# EAGLE design uMinion (EAGLE 9.2.2)
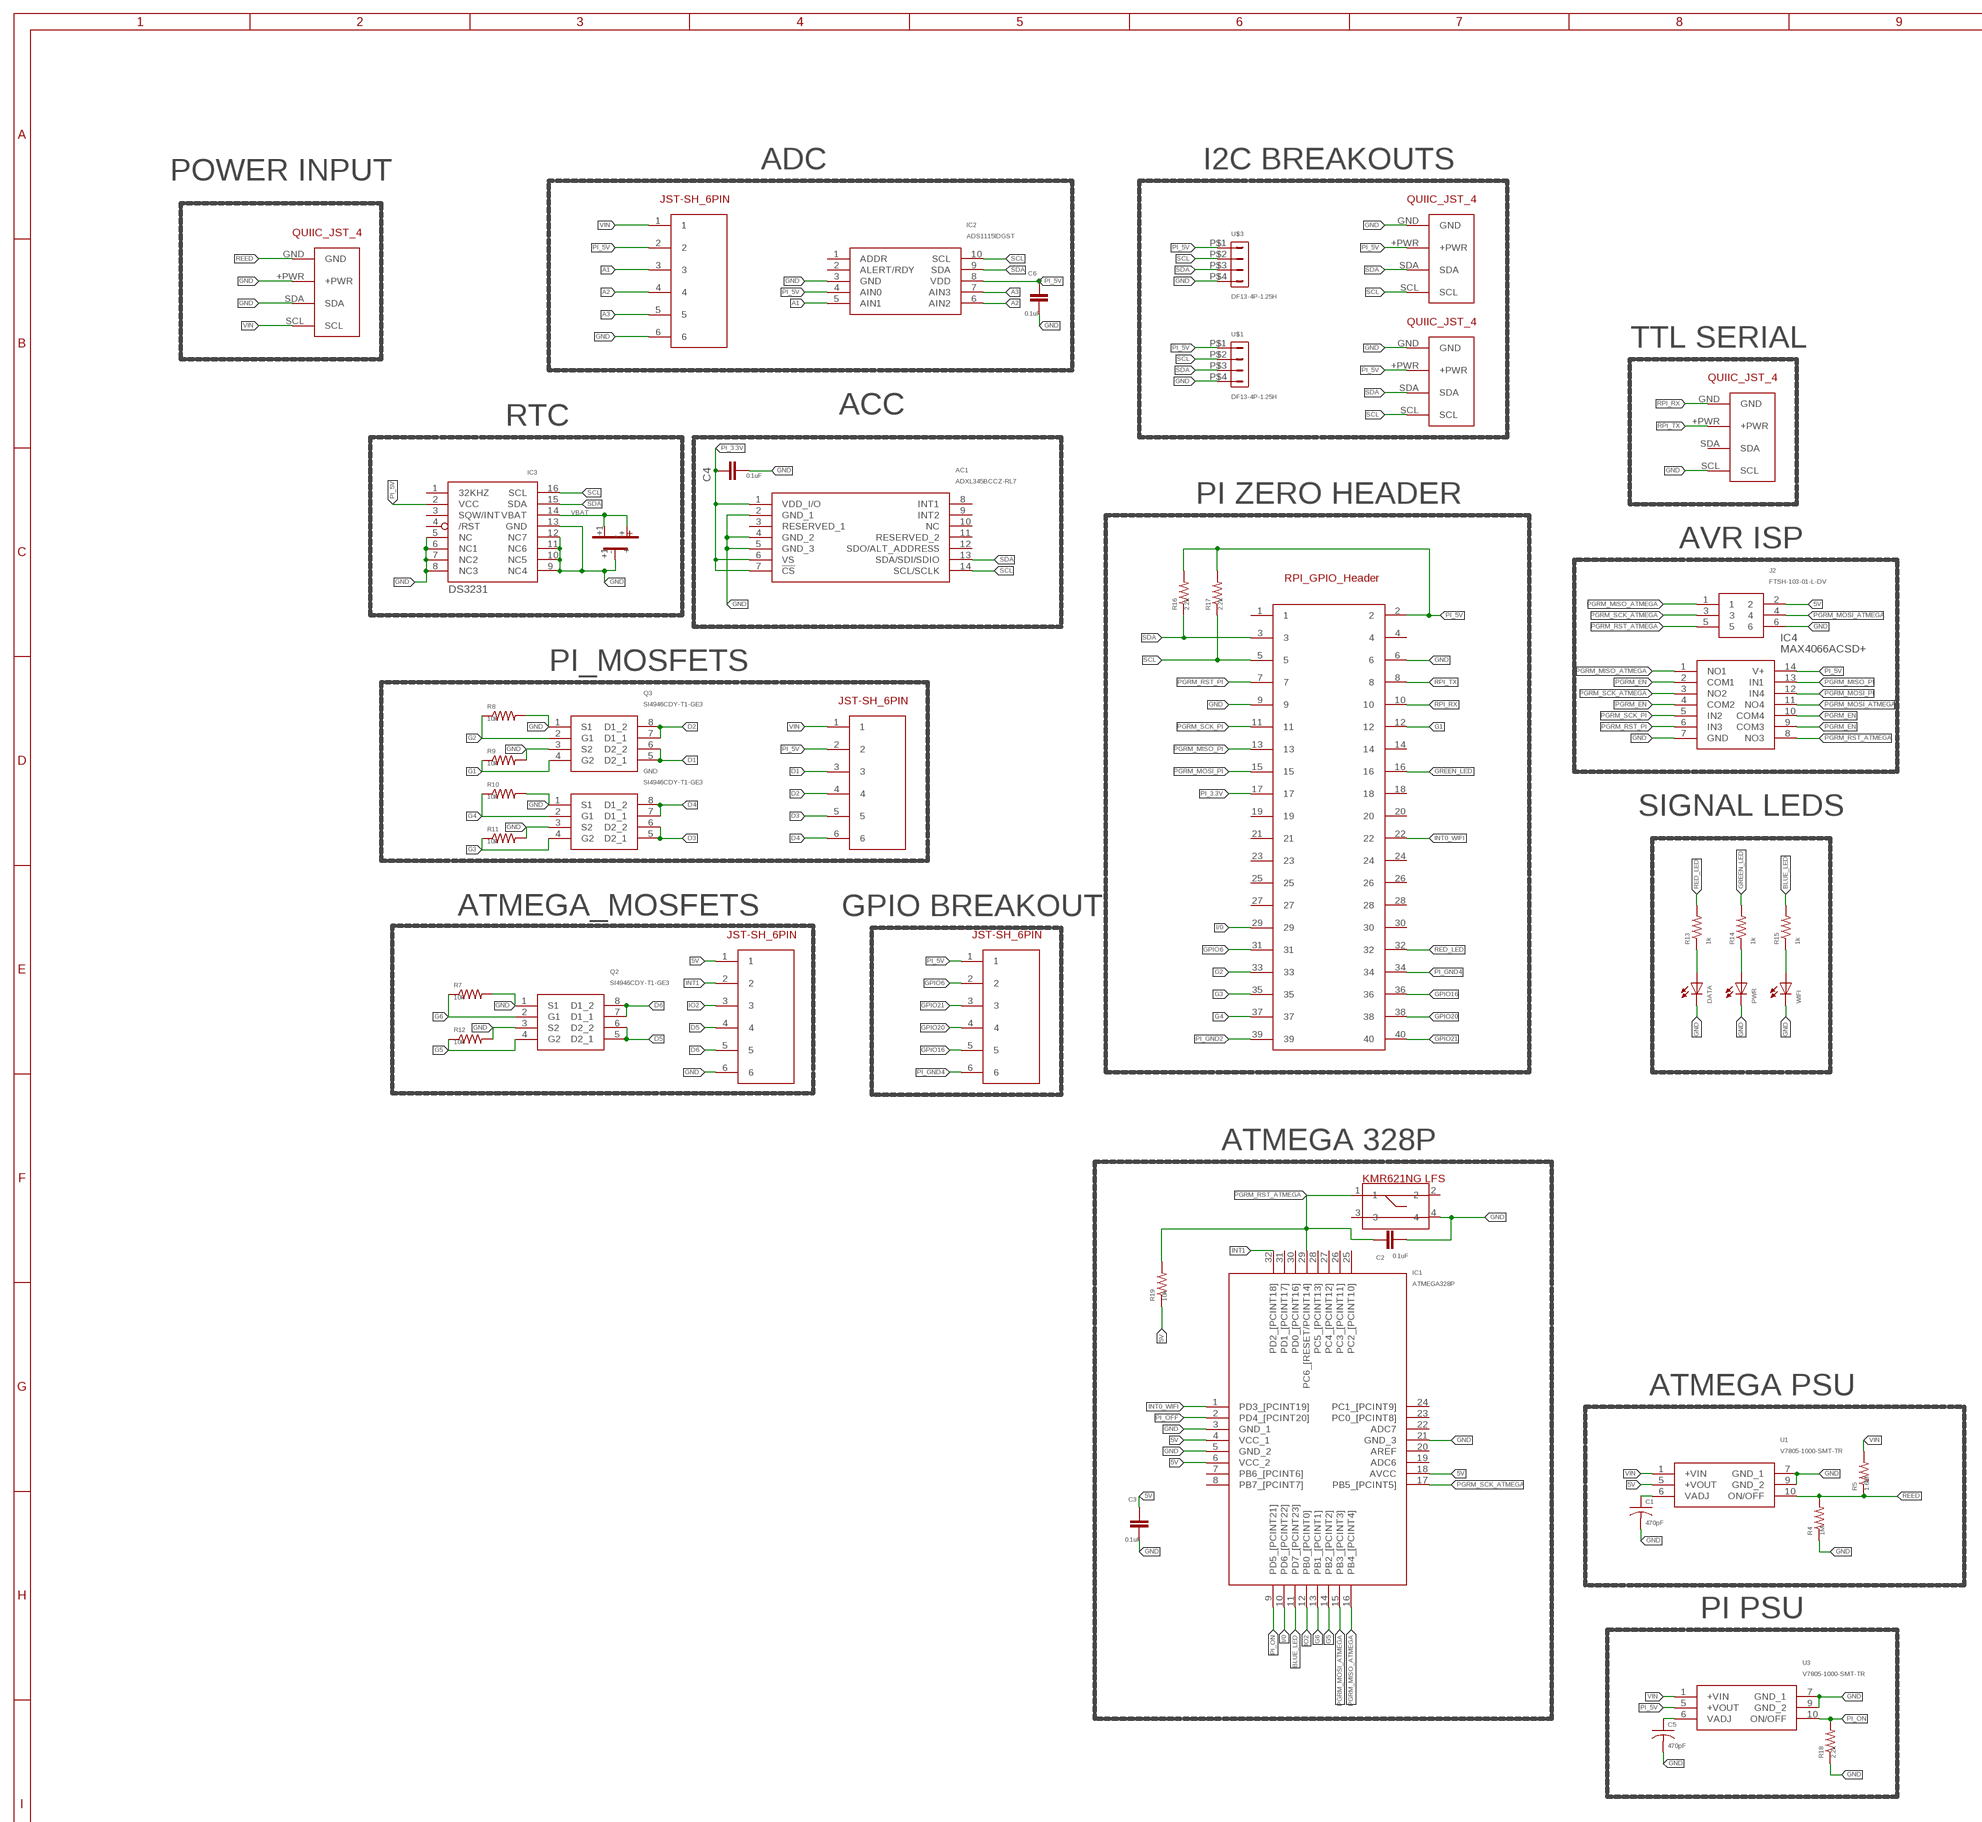
[diagram p0: schematic, sheet 1, part 1 of 2]
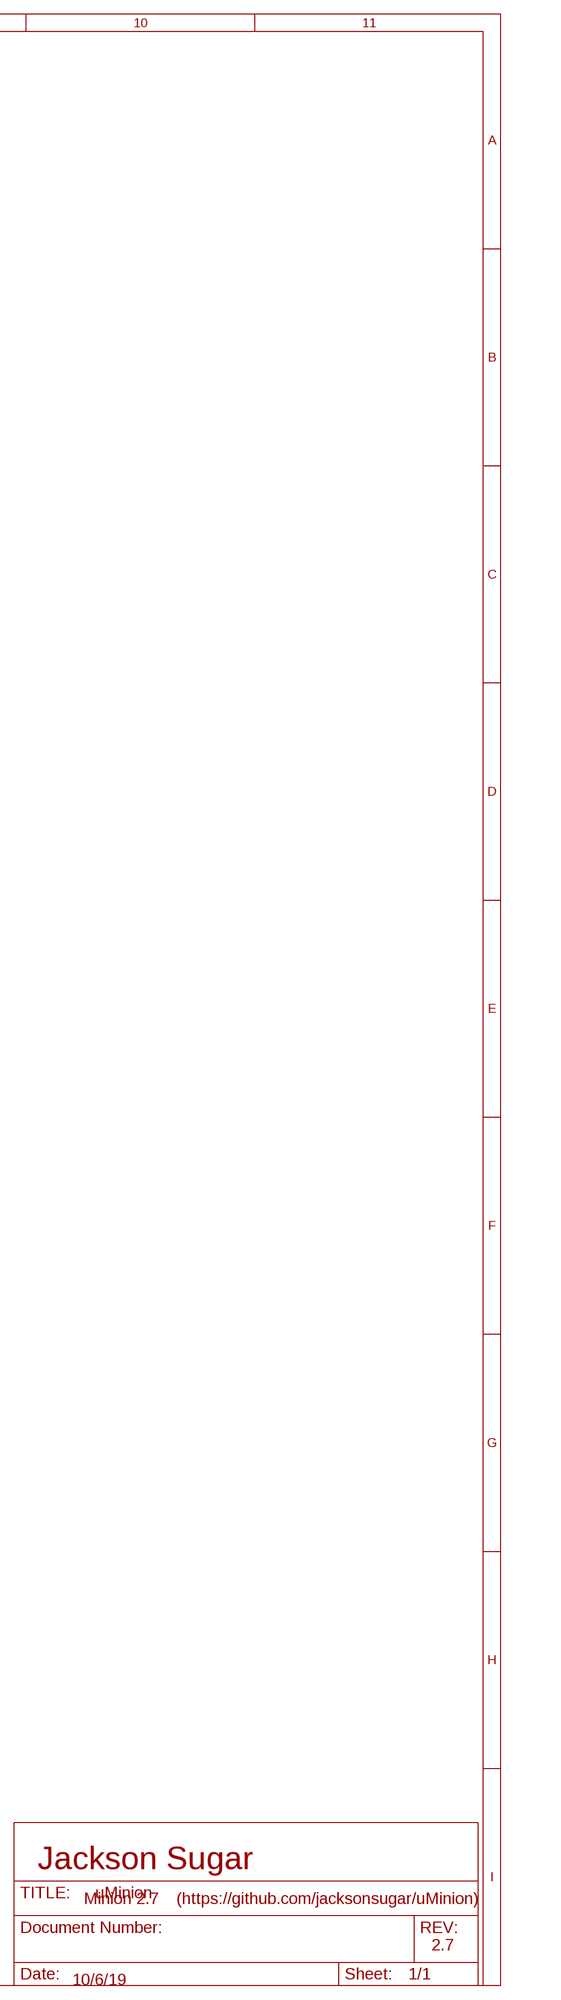
[diagram p1: schematic, sheet 1, part 2 of 2]

## Parts
AC1  ADXL345BCCZ-RL7  [CC-14-1]
C1  470pF  C-USC1206  [C1206]
C2  0.1uF  CC0805KRX7R9BB104  [CAP_0805]
C3  0.1uF  CC0805KRX7R9BB104  [CAP_0805]
C4  0.1uF  CC0805KRX7R9BB104  [CAP_0805]
C5  470pF  C-USC1206  [C1206]
C6  0.1uF  CC0805KRX7R9BB104  [CAP_0805]
DATA  LED_E  [LED_1206]
GND  SI4946CDY-T1-GE3  [SOIC127P600X175-8N]
IC1  ATMEGA328P  ATMEGA328P-AU  [QFP80P900X900X120-32N]
IC2  ADS1115IDGST  [SOP50P490X110-10N]
IC3  DS3231/SO  [SO16W]
IC4  MAX4066ACSD+  [SOIC127P600X175-14N]
J2  FTSH-103-01-L-DV  [SAMTEC_FTSH-103-01-L-DV]
PWR  LED_E  [LED_1206]
Q2  SI4946CDY-T1-GE3  [SOIC127P600X175-8N]
Q3  SI4946CDY-T1-GE3  [SOIC127P600X175-8N]
R4  1M  10KOHM-0603-1/10W-1%  [0603]
R5  1.6M  10KOHM-0603-1/10W-1%  [0603]
R7  10k  10KOHM-0603-1/10W-1%  [0603]
R8  10k  10KOHM-0603-1/10W-1%  [0603]
R9  10k  10KOHM-0603-1/10W-1%  [0603]
R10  10k  10KOHM-0603-1/10W-1%  [0603]
R11  10k  10KOHM-0603-1/10W-1%  [0603]
R12  10k  10KOHM-0603-1/10W-1%  [0603]
R13  1k  R-US_M1206  [M1206]
R14  1k  R-US_M1206  [M1206]
R15  1k  R-US_M1206  [M1206]
R16  2.2k  10KOHM-0603-1/10W-1%  [0603]
R17  2.2k  10KOHM-0603-1/10W-1%  [0603]
R18  2.2k  10KOHM-0603-1/10W-1%  [0603]
R19  10k  10KOHM-0603-1/10W-1%  [0603]
U1  V7805-1000-SMT-TR  [V7805500SMTTR]
U3  V7805-1000-SMT-TR  [V7805500SMTTR]
U$1  DF13-4P-1.25H  [DF13A-4P-1.25H]
U$2  JST-SH_6PIN  [JST-SH_6PIN]
U$3  DF13-4P-1.25H  [DF13A-4P-1.25H]
U$5  QUIIC_JST_4  [QUIIC_JST_4]
U$6  QUIIC_JST_4  [QUIIC_JST_4]
U$7  QUIIC_JST_4  [QUIIC_JST_4]
U$8  JST-SH_6PIN  [JST-SH_6PIN]
U$9  40PIN_FEMALE_HEADER_SMD  [40PIN_FEMALE_HEADER_SMD]
U$10  QUIIC_JST_4  [QUIIC_JST_4]
U$11  CR1220_HOLDER  [CR1220_HOLDER]
U$12  KMR621NGLFS  [KMR621NGLFS]
U$13  JST-SH_6PIN  [JST-SH_6PIN]
U$14  JST-SH_6PIN  [JST-SH_6PIN]
WIFI  LED_E  [LED_1206]

## Nets
5V: C3.1 IC1.4(VCC_1) IC1.6(VCC_2) IC1.18(AVCC) J2.2 R19.1 U1.5(+VOUT) U$14.1
A1: IC2.5(AIN1) U$2.3
A2: IC2.6(AIN2) U$2.4
A3: IC2.7(AIN3) U$2.5
BLUE_LED: IC1.11(PD7_[PCINT23]) R15.2
D1: Q3.5(D2_1) Q3.6(D2_2) U$8.3
D2: Q3.7(D1_1) Q3.8(D1_2) U$8.4
D3: GND.5(D2_1) GND.6(D2_2) U$8.5
D4: GND.7(D1_1) GND.8(D1_2) U$8.6
D5: Q2.5(D2_1) Q2.6(D2_2) U$14.4
D6: Q2.7(D1_1) Q2.8(D1_2) U$14.5
G1: Q3.4(G2) R9.1 U$9.12
G2: Q3.2(G1) R8.1 U$9.33
G3: GND.4(G2) R11.1 U$9.35
G4: GND.2(G1) R10.1 U$9.37
G5: IC1.14(PB2_[PCINT2]) Q2.4(G2) R12.1
G6: IC1.13(PB1_[PCINT1]) Q2.2(G1) R7.1
GND: AC1.2(GND_1) AC1.4(GND_2) AC1.5(GND_3) C1.2 C2.2 C3.2 C4.2 C5.2 C6.2 DATA.C GND.1(S1) GND.3(S2) IC1.3(GND_1) IC1.5(GND_2) IC1.21(GND_3) IC2.3(GND) IC3.5(NC) IC3.6(NC1) IC3.7(NC2) IC3.8(NC3) IC3.9(NC4) IC3.10(NC5) IC3.11(NC6) IC3.12(NC7) IC3.13(GND) IC4.7(GND) J2.6 PWR.C Q2.1(S1) Q2.3(S2) Q3.1(S1) Q3.3(S2) R4.1 R7.2 R8.2 R9.2 R10.2 R11.2 R12.2 R18.1 U1.7(GND_1) U1.9(GND_2) U3.7(GND_1) U3.9(GND_2) U$1.P$4 U$2.6 U$3.P$4 U$5.SCL U$6.GND U$7.GND U$9.6 U$9.9 U$10.+PWR U$10.SDA U$11.- U$12.4 U$14.6 WIFI.C
GPIO6: U$9.31 U$13.2
GPIO16: U$9.36 U$13.5
GPIO20: U$9.38 U$13.4
GPIO21: U$9.40 U$13.3
GREEN_LED: R14.2 U$9.16
I/0: IC1.10(PD6_[PCINT22]) U$9.29
INT0_WIFI: IC1.1(PD3_[PCINT19]) U$9.22
INT1: IC1.32(PD2_[PCINT18]) U$14.2
IO2: IC1.12(PB0_[PCINT0]) U$14.3
N$2: C1.1 U1.6(VADJ)
N$3: C5.1 U3.6(VADJ)
N$8: R15.1 WIFI.A
N$10: DATA.A R13.1
N$11: PWR.A R14.1
PGRM_EN: IC4.2(COM1) IC4.4(COM2) IC4.9(COM3) IC4.10(COM4)
PGRM_MISO_ATMEGA: IC1.16(PB4_[PCINT4]) IC4.1(NO1) J2.1
PGRM_MISO_PI: IC4.13(IN1) U$9.13
PGRM_MOSI_ATMEGA: IC1.15(PB3_[PCINT3]) IC4.11(NO4) J2.4
PGRM_MOSI_PI: IC4.12(IN4) U$9.15
PGRM_RST_ATMEGA: C2.1 IC1.29(PC6_[RESET/PCINT14]) IC4.8(NO3) J2.5 R19.2 U$12.1
PGRM_RST_PI: IC4.6(IN3) U$9.7
PGRM_SCK_ATMEGA: IC1.17(PB5_[PCINT5]) IC4.3(NO2) J2.3
PGRM_SCK_PI: IC4.5(IN2) U$9.11
PI_3.3V: AC1.1(VDD_I/O) AC1.6(VS) AC1.7(!CS) C4.1 U$9.17
PI_5V: C6.1 IC2.4(AIN0) IC2.8(VDD) IC3.2(VCC) IC4.14(V+) R16.2 R17.2 U3.5(+VOUT) U$1.P$1 U$2.2 U$3.P$1 U$6.+PWR U$7.+PWR U$8.2 U$9.2 U$13.1
PI_GND2: U$9.39
PI_GND4: U$9.34 U$13.6
PI_OFF: IC1.2(PD4_[PCINT20])
PI_ON: IC1.9(PD5_[PCINT21]) R18.2 U3.10(ON/OFF)
RED_LED: R13.2 U$9.32
REED: R4.2 R5.1 U1.10(ON/OFF) U$10.GND
RPI_RX: U$5.GND U$9.10
RPI_TX: U$5.+PWR U$9.8
SCL: AC1.14(SCL/SCLK) IC2.10(SCL) IC3.16(SCL) R17.1 U$1.P$2 U$3.P$2 U$6.SCL U$7.SCL U$9.5
SDA: AC1.13(SDA/SDI/SDIO) IC2.9(SDA) IC3.15(SDA) R16.1 U$1.P$3 U$3.P$3 U$6.SDA U$7.SDA U$9.3
VBAT: IC3.14(VBAT) U$11.+ U$11.+1
VIN: R5.2 U1.1(+VIN) U3.1(+VIN) U$2.1 U$8.1 U$10.SCL
Unconnected: AC1.3(RESERVED_1) AC1.8(INT1) AC1.9(INT2) AC1.10(NC) AC1.11(RESERVED_2) AC1.12(SDO/ALT_ADDRESS) IC1.7(PB6_[PCINT6]) IC1.8(PB7_[PCINT7]) IC1.19(ADC6) IC1.20(AREF) IC1.22(ADC7) IC1.23(PC0_[PCINT8]) IC1.24(PC1_[PCINT9]) IC1.25(PC2_[PCINT10]) IC1.26(PC3_[PCINT11]) IC1.27(PC4_[PCINT12]) IC1.28(PC5_[PCINT13]) IC1.30(PD0_[PCINT16]) IC1.31(PD1_[PCINT17]) IC2.1(ADDR) IC2.2(ALERT/RDY) IC3.1(32KHZ) IC3.3(SQW/INT) IC3.4(/RST) U$5.SDA U$9.1 U$9.4 U$9.14 U$9.18 U$9.19 U$9.20 U$9.21 U$9.23 U$9.24 U$9.25 U$9.26 U$9.27 U$9.28 U$9.30 U$12.2 U$12.3

## Notes on the sheet
- ADC | I2C BREAKOUTS
- POWER INPUT
- TTL SERIAL
- ACC
- RTC
- PI ZERO HEADER
- AVR ISP
- PI_MOSFETS
- SIGNAL LEDS
- ATMEGA_MOSFETS | GPIO BREAKOUT
- ATMEGA 328P
- ATMEGA PSU
- PI PSU
- Jackson Sugar
- Minion 2.7 | (https://github.com/jacksonsugar/uMinion)
- 2.7
- 10/6/19

## Library data of the parts
AC1 = SamacSys_Parts:ADXL345BCCZ-RL7: ADXL345BCCZ-RL7 Analog Devices, 3-Axis Accelerometer, I2C, SPI, 14-Pin LGA Source: Datasheet <https://componentsearchengine.com/Datasheets/1/ADXL345BCCZ-RL7.pdf>; DESCRIPTION: ADXL345BCCZ-RL7 Analog Devices, 3-Axis Accelerometer, I2C, SPI, 14-Pin LGA; HEIGHT: mm; MANUFACTURER_NAME: Analog Devices; MANUFACTURER_PART_NUMBER: ADXL345BCCZ-RL7; MOUSER_PART_NUMBER: 584-ADXL345BCCZ-R7
C1 C5 = adafruit:C-US: CAPACITOR, American symbol
C2-C4 C6 = Resistor_Capacitor:CC0805KRX7R9BB104: CAP CER 0.1UF 50V X7R 0805 Manufacturer's datasheet <http://www.yageo.com/documents/recent/UPY-GPHC_X7R_6.3V-to-50V_18.pdf>; CREATED_BY: PCBLayout.com; DIGIKEY_PART_NUMBER: 311-1140-2-ND; MANUFACTURER: Yageo; MPN: CC0805KRX7R9BB104; PACKAGE: SMD 0805
DATA PWR WIFI = eagle-ltspice:LED_E: LED Source: http://www.osram.convergy.de Source: www.luxeon.com Source: www.kingbright.com; SPICEMODEL: NONE; SPICEPREFIX: D; SPICETYPE: diode
GND Q2 Q3 = SamacSys_Parts:SI4946CDY-T1-GE3: VISHAY - SI4946CDY-T1-GE3 - MOSFET, DUAL N-CH, 60V, SOIC Source: Datasheet <https://componentsearchengine.com/Datasheets/1/SI4946CDY-T1-GE3.pdf>; DESCRIPTION: VISHAY - SI4946CDY-T1-GE3 - MOSFET, DUAL N-CH, 60V, SOIC; HEIGHT: 1.75mm; MANUFACTURER_NAME: Vishay; MANUFACTURER_PART_NUMBER: SI4946CDY-T1-GE3; MOUSER_PART_NUMBER: 78-SI4946CDY-T1-GE3
IC1 = SamacSys_Parts:ATMEGA328P-AU: MICROCHIP - ATMEGA328P-AU. - MICROCONTROLLER MCU, 8 BIT, ATMEGA, 20MHZ, TQFP-32 Source: Datasheet <https://componentsearchengine.com/Datasheets/1/ATMEGA328P-AU.pdf>; DESCRIPTION: MICROCHIP - ATMEGA328P-AU. - MICROCONTROLLER MCU, 8 BIT, ATMEGA, 20MHZ, TQFP-32; HEIGHT: 1.2mm; MANUFACTURER_NAME: Microchip; MANUFACTURER_PART_NUMBER: ATMEGA328P-AU; MOUSER_PART_NUMBER: 556-ATMEGA328P-AU
IC2 = SamacSys_Parts:ADS1115IDGST: 16-Bit, 860SPS, 4-Ch Delta-Sigma ADC w/ PGA, Oscillator, Voltage Reference, Comparator & I2C Source: Datasheet; DESCRIPTION: 16-Bit, 860SPS, 4-Ch Delta-Sigma ADC w/ PGA, Oscillator, Voltage Reference, Comparator & I2C; HEIGHT: 1.1mm; MANUFACTURER_NAME: Texas Instruments; MANUFACTURER_PART_NUMBER: ADS1115IDGST; MOUSER_PART_NUMBER: 595-ADS1115IDGST
IC3 = adafruit:DS3231
IC4 = SamacSys_Parts:MAX4066ACSD+: MAX4066ACSD+, Analogue SPST Switch Quad SPST, 3, 5, 12V, 14-Pin, SOIC Source: Datasheet <https://componentsearchengine.com/Datasheets/1/MAX4066ACSD .pdf>; DESCRIPTION: MAX4066ACSD+, Analogue SPST Switch Quad SPST, 3, 5, 12V, 14-Pin, SOIC; HEIGHT: 1.75mm; MANUFACTURER_NAME: Maxim Integrated; MANUFACTURER_PART_NUMBER: MAX4066ACSD+; MOUSER_PART_NUMBER: 700-MAX4066ACSD; MOUSER_PRICE-STOCK: https://www.mouser.com/Search/Refine.aspx?Keyword=700-MAX4066ACSD
J2 = SamacSys_Parts:FTSH-103-01-L-DV: CONN HEADER, 1.27MM, 2X3WAY, SMT Source: Datasheet <https://componentsearchengine.com/Datasheets/1/FTSH-103-01-L-DV.pdf>; DESCRIPTION: CONN HEADER, 1.27MM, 2X3WAY, SMT; HEIGHT: mm; MANUFACTURER_NAME: SAMTEC; MANUFACTURER_PART_NUMBER: FTSH-103-01-L-DV; MOUSER_PART_NUMBER: 200-FTSH10301LDV
R4 R5 R16-R18 = SparkFun-Resistors:10KOHM: 10kΩ resistor A resistor is a passive two-terminal electrical component that implements electrical resistance as a circuit element. Resistors act to reduce current flow, and, at the same time, act to lower voltage levels within circuits. - Wikipedia; PROD_ID: RES-00824; VALUE: 10k
R7-R12 R19 = SparkFun-Resistors:10KOHM: 10kΩ resistor A resistor is a passive two-terminal electrical component that implements electrical resistance as a circuit element. Resistors act to reduce current flow, and, at the same time, act to lower voltage levels within circuits. - Wikipedia; PROD_ID: RES-00824
R13-R15 = rcl:R-US_: RESISTOR, American symbol; SPICEPREFIX: R
U1 U3 = SamacSys_Parts:V7805-1000-SMT-TR: Non-Isolated DC/DC Converters Non-Isolated D C-DC Cnvrt Source: Datasheet <https://componentsearchengine.com/Datasheets/1/V7805-1000-SMT-TR.pdf>; DESCRIPTION: Non-Isolated DC/DC Converters Non-Isolated D C-DC Cnvrt; HEIGHT: 7mm; MANUFACTURER_NAME: CUI; MANUFACTURER_PART_NUMBER: V7805-1000-SMT-TR; MOUSER_PART_NUMBER: 490-V78051000-SMT-TR; MOUSER_PRICE-STOCK: https://www.mouser.com/Search/Refine.aspx?Keyword=490-V78051000-SMT-TR
U$1 U$3 = con-hirose-df13:DF13-4P-1.25: DF13-4P 1.25mm Pitch Miniature Crimping Connector.
U$2 U$8 U$13 U$14 = JST-SH_6PIN:JST-SH_6PIN
U$5-U$7 U$10 = QUIIC_JST_4:QUIIC_JST_4
U$9 = 40Pin_Female_Header_SMD:40PIN_FEMALE_HEADER_SMD
U$11 = CR1220_HOLDER:CR1220_HOLDER
U$12 = KMR621NG LFS:KMR621NGLFS

## Board
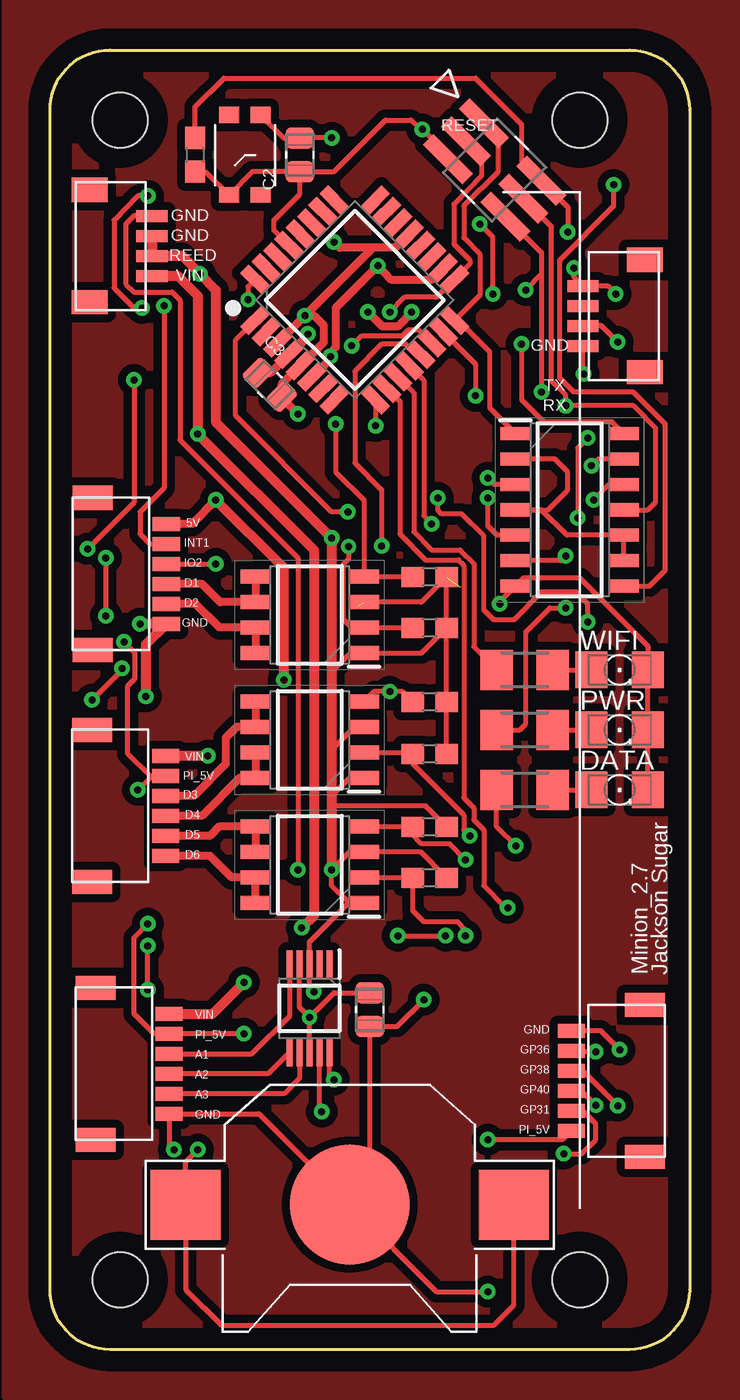
[diagram p2: board, top side]
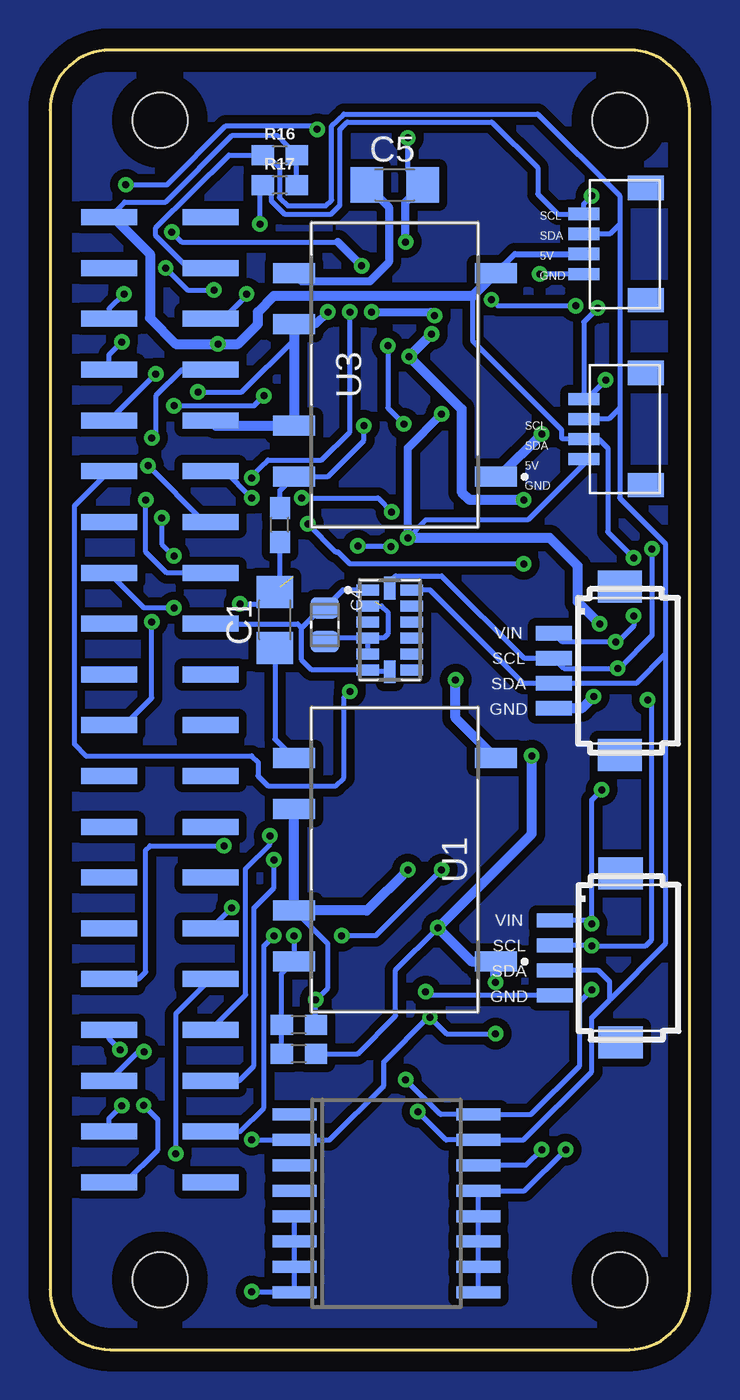
[diagram p3: board, bottom side, seen from below]

Size 32 x 65 mm. Coordinates in mm from the lower left corner, seen from the top.
Outline: 0,3 0,62 arc-90 3,65 29,65 arc-90 32,62 32,3 arc-90 29,0 3,0 arc-90 0,3
Copper layers (1*16): Top 0.035mm / dielectric 1.5mm / Bottom 0.035mm
Design rules "default": minimum track width 6mil, minimum drill 0.35mm, track to track 6mil, track to pad 6mil, pad to pad 6mil, via to via 6mil, smd to smd 6mil, copper to edge 40mil, drill to drill 6mil, minimum pad ring 10mil, minimum via ring 8mil, stop-mask expansion 4mil, vias tented up to drill 0mil, thermal gap 10mil
Holes 2.75 mm at 3.5,61.5 3.5,3.5 26.5,3.5 26.5,61.5

### Footprints (pad centres in the part's own frame; a part is rotated, then mirrored left to right if it is on the bottom)
CC-14-1 = smd 1.145 x 0.55: 1 -1.097,2; 2 -1.097,1.2; 3 -1.097,0.4; 4 -1.097,-0.4; 5 -1.097,-1.2; 6 -1.097,-2; 8 1.097,-2; 9 1.097,-1.2; 10 1.097,-0.4; 11 1.097,0.4; 12 1.097,1.2; 13 1.097,2 | smd 0.55 x 1.145: 7 0,-2.098; 14 0,2.098
C1206 = smd 1.6 x 1.8: 1 -1.4,0; 2 1.4,0
CAP_0805 = smd 1.05 x 1.38: 1 -0.84,0; 2 0.84,0
LED_1206 = smd 1.6 x 1.803: A -1.422,0; C 1.422,0
SOIC127P600X175-8N = smd 1.525 x 0.7: 1 -2.712,1.905; 2 -2.712,0.635; 3 -2.712,-0.635; 4 -2.712,-1.905; 5 2.712,-1.905; 6 2.712,-0.635; 7 2.712,0.635; 8 2.712,1.905
QFP80P900X900X120-32N = smd 1.5 x 0.6: 1 -4.25,2.8; 2 -4.25,2; 3 -4.25,1.2; 4 -4.25,0.4; 5 -4.25,-0.4; 6 -4.25,-1.2; 7 -4.25,-2; 8 -4.25,-2.8; 17 4.25,-2.8; 18 4.25,-2; 19 4.25,-1.2; 20 4.25,-0.4; 21 4.25,0.4; 22 4.25,1.2; 23 4.25,2; 24 4.25,2.8 | smd 0.6 x 1.5: 9 -2.8,-4.25; 10 -2,-4.25; 11 -1.2,-4.25; 12 -0.4,-4.25; 13 0.4,-4.25; 14 1.2,-4.25; 15 2,-4.25; 16 2.8,-4.25; 25 2.8,4.25; 26 2,4.25; 27 1.2,4.25; 28 0.4,4.25; 29 -0.4,4.25; 30 -1.2,4.25; 31 -2,4.25; 32 -2.8,4.25
SOP50P490X110-10N = smd 1.4 x 0.3: 1 -2.2,1; 2 -2.2,0.5; 3 -2.2,0; 4 -2.2,-0.5; 5 -2.2,-1; 6 2.2,-1; 7 2.2,-0.5; 8 2.2,0; 9 2.2,0.5; 10 2.2,1
SO16W = smd 0.6 x 2.2: 1 -4.445,-4.6; 2 -3.175,-4.6; 3 -1.905,-4.6; 4 -0.635,-4.6; 5 0.635,-4.6; 6 1.905,-4.6; 7 3.175,-4.6; 8 4.445,-4.6; 9 4.445,4.6; 10 3.175,4.6; 11 1.905,4.6; 12 0.635,4.6; 13 -0.635,4.6; 14 -1.905,4.6; 15 -3.175,4.6; 16 -4.445,4.6
SOIC127P600X175-14N = smd 1.525 x 0.65: 1 -2.712,3.81; 2 -2.712,2.54; 3 -2.712,1.27; 4 -2.712,0; 5 -2.712,-1.27; 6 -2.712,-2.54; 7 -2.712,-3.81; 8 2.712,-3.81; 9 2.712,-2.54; 10 2.712,-1.27; 11 2.712,0; 12 2.712,1.27; 13 2.712,2.54; 14 2.712,3.81
SAMTEC_FTSH-103-01-L-DV = smd 0.762 x 2.794: 1 -1.27,-2.032; 2 -1.27,2.032; 3 0,-2.032; 4 0,2.032; 5 1.27,-2.032; 6 1.27,2.032
0603 = smd 1.1 x 1: 1 -0.85,0; 2 0.85,0
M1206 = smd 1.6 x 2: 1 -1.4,0; 2 1.4,0
V7805500SMTTR = smd 1 x 2.1: 1 -5.08,-4.8; 5 5.08,-4.8; 6 5.08,5.3; 7 2.54,5.3; 9 -2.54,5.3; 10 -5.08,5.3
DF13A-4P-1.25H = smd 1.6 x 2.2: M$0 -4.225,2.4; M$1 4.225,2.4 | smd 0.7 x 1.8: P$1 -1.875,-0.9; P$2 -0.625,-0.9; P$3 0.625,-0.9; P$4 1.875,-0.9
JST-SH_6PIN = smd 1.35 x 0.7: 1 4.675,6.3; 2 4.675,5.3; 3 4.675,4.3; 4 4.675,3.3; 5 4.675,2.3; 6 4.675,1.3 | smd 2 x 1.2: P$1 1,0; P$2 1,7.6
QUIIC_JST_4 = smd 1.55 x 0.6: +PWR 3.8,3.7; GND 3.8,4.7; SCL 3.8,1.7; SDA 3.8,2.7 | smd 1.8 x 1.2: P$1 0.7,0.4; P$2 0.7,6
40PIN_FEMALE_HEADER_SMD = smd 2.8 x 0.8 bottom: 1 -2.54,24.13; 2 2.54,24.13; 3 -2.54,21.59; 4 2.54,21.59; 5 -2.54,19.05; 6 2.54,19.05; 7 -2.54,16.51; 8 2.54,16.51; 9 -2.54,13.97; 10 2.54,13.97; 11 -2.54,11.43; 12 2.54,11.43; 13 -2.54,8.89; 14 2.54,8.89; 15 -2.54,6.35; 16 2.54,6.35; 17 -2.54,3.81; 18 2.54,3.81; 19 -2.54,1.27; 20 2.54,1.27; 21 -2.54,-1.27; 22 2.54,-1.27; 23 -2.54,-3.81; 24 2.54,-3.81; 25 -2.54,-6.35; 26 2.54,-6.35; 27 -2.54,-8.89; 28 2.54,-8.89; 29 -2.54,-11.43; 30 2.54,-11.43; 31 -2.54,-13.97; 32 2.54,-13.97; 33 -2.54,-16.51; 34 2.54,-16.51; 35 -2.54,-19.05; 36 2.54,-19.05; 37 -2.54,-21.59; 38 2.54,-21.59; 39 -2.54,-24.13; 40 2.54,-24.13
CR1220_HOLDER = smd 3.5 x 3.5: + -8.2,0; +1 8.2,0 | smd 6 x 6: - 0,0
KMR621NGLFS = smd 0.8 x 1: 1 -2,0.8; 2 2,0.8; 3 -2,-0.8; 4 2,-0.8

### Placement (x,y rotation side)
AC1  15,36 0 bottom
C1  20.75,36.5 90 bottom
C2  12.5,59.75 90 top
C3  11,48.25 315 top
C4  18.25,36.25 270 bottom
C5  14.75,58.25 0 bottom
C6  16,17 270 top
DATA  28.5,28 0 top
GND  13,24.25 180 top
IC1  15.25,52.5 45 top
IC2  12.98,17.07 270 top
IC3  15.17,7.31 270 bottom
IC4  26,42 0 top
J2  22.25,59 225 top
PWR  28.5,31 0 top
Q2  13,36.75 180 top
Q3  13,30.5 180 top
R4  19.55,16.25 180 bottom
R5  19.55,14.8 0 bottom
R7  19,36.1 0 top
R8  19,29.8 0 top
R9  19,32.4 0 top
R10  19,23.6 0 top
R11  19,26.15 0 top
R12  19,38.65 0 top
R13  23.75,28 180 top
R14  23.75,31 180 top
R15  23.75,34 180 top
R16  20.5,59.75 0 bottom
R17  20.5,58.25 0 bottom
R18  20.5,41.25 90 bottom
R19  7.25,59.75 270 top
U1  14.5,24.5 90 bottom
U3  14.5,48.75 90 bottom
U$1  5.85,19.58 270 bottom
U$2  1.3,10.5 0 top
U$3  5.88,33.95 270 bottom
U$5  30.45,54.9 180 top
U$6  1.5,58.5 180 bottom
U$7  1.5,49.25 180 bottom
U$8  1.1,23.4 0 top
U$9  26.5,32.5 0 top
U$10  1.3,52 0 top
U$11  15,7.25 180 top
U$12  9.75,59.75 90 top
U$13  30.75,17.25 180 top
U$14  1.15,35 0 top
WIFI  28.5,34 0 top

### Tracks (layer width: path | path; a pad name or v marks a point on that pad's centre or on a via)
5V  (via drill 0.35)
  Top 0.254: R19.1 7.25,62.15 8.7,63.6 21.3,63.6 23.6,61.3 23.6,59.45 J2.2 25.9,57.15 v25.9,55.9
  Top 0.406: C3.1 11.03,48.84 IC1.4 | IC1.6 13.15,48.65 14.03,49.53 | v14.03,49.67 14.03,49.85 14.31,50.13 14.31,52.11 v16.4,54.2 17.1,53.5 19.08,53.5 IC1.18 | v8.3,42.5 7.1,41.3 U$14.1
  Top 0.508: v11.7,33.5 11.7,39.1 v8.3,42.5 | IC1.4 12.9,50.72 v12.9,50.8 | v14.03,49.67 14.03,49.53
  Bottom 0.254: v25.9,55.9 25.4,55.4 17.6,55.4
  Bottom 0.406: 17.6,55.4 v16.4,54.2
  Bottom 0.508: U1.5 11.7,31.58 v11.7,33.5 | v8.3,42.5 11,42.5 11.4,42.9 11.4,47.05 v14.03,49.67 v12.9,50.8
A1
  Top 0.254: U$2.3 10.1,14.8 12,16.7 12,19.25 IC2.5
A2
  Top 0.254: IC2.6 10.91,13.8 U$2.4
A3
  Top 0.254: IC2.7 12.48,13.58 11.7,12.8 U$2.5
BLUE_LED
  Top 0.254: IC1.11 18.2,47.85 18.2,40.9 19.1,40 20.52,40 21.2,39.32 21.2,35.15 R15.2
BOT
  pour Bottom (isolate 0.406): -2.86,69.51 35.77,69.51 35.77,-3.74 -3.42,-3.74 -3.42,69.46 -2.85,69.46
D1
  Top 0.406: Q3.5 Q3.6 9.34,31.13 8.8,30.6 8.8,29.3 7.2,27.7 U$8.3
D2
  Top 0.406: Q3.7 Q3.8 9.49,28.59 7.6,26.7 U$8.4
D3
  Top 0.406: GND.6 GND.5 8.45,26.16 8,25.7 U$8.5
D4
  Top 0.406: GND.8 GND.7 9.09,23.61 8,24.7 U$8.6
D5
  Top 0.406: Q2.5 Q2.6 8.52,37.38 7.6,38.3 U$14.4
D6
  Top 0.406: Q2.8 Q2.7 8.48,36.12 7.3,37.3 U$14.5
G1  (via drill 0.35)
  Top 0.254: Q3.4 16.21,32.91 v17,32.91 17.64,32.91 R9.1
  Bottom 0.254: U$9.12 30.78,42.19 30.78,30.28 30.2,29.7 21.9,29.7 21.6,29.4 21.6,28.7 21.1,28.2 17.7,28.2 17.3,28.6 17.3,32.6 v17,32.91
G2  (via drill 0.35)
  Top 0.254: Q3.2 18.08,29.87 R8.1 18.15,29.3 20.7,26.75 20.7,26 v21,25.7
  Bottom 0.254: U$9.33 22.21,17.74 22.21,24.07 21,25.27 v21,25.7
G3  (via drill 0.35)
  Top 0.254: GND.4 R11.1 | R11.1 | v20.8,24.5 20,25.3 18.6,25.3 18.14,25.75 R11.1
  Bottom 0.254: U$9.35 22.55,13.45 21.8,14.2 21.8,22.1 20.8,23.1 v20.8,24.5
G4  (via drill 0.35)
  Top 0.254: GND.2 18.14,23.61 R10.1 18.15,21.95 18.7,21.4 20.4,21.4 20.8,21 v20.8,20.7
  Bottom 0.254: U$9.37 22.49,10.91 21.3,12.1 21.3,20.2 v20.8,20.7
G5  (via drill 0.35)
  Top 0.254: R12.1 Q2.4 15.7,42.5 14.3,43.9 v14.3,46.3 | IC1.14 18.45,51 17.92,51 17.6,50.68 15.58,50.68 v15.1,50.2
  Bottom 0.254: v15.1,50.2 15.1,47.1 v14.3,46.3
G6  (via drill 0.35)
  Top 0.254: R7.1 18.14,36.12 Q2.2 15.08,36.12 14.67,36.53 14.67,39.27 14.94,39.54 v14.94,40.16 | IC1.13 18.22,50.1 18,50.1 17.8,50.3 17.77,50.28 16.6,50.28 15.25,48.93 15.25,44.35 16.6,43 v16.6,40.2
  Bottom 0.254: v16.6,40.2 14.98,40.2 v14.94,40.16
GND  (via drill 0.35)  (2 unrouted)
  Top 0.254: U$11.- 10.45,11.8 U$2.6 5.98,10.22 v6.2,10 | U$11.- 19.35,2.9 v21.9,2.9 | v18.7,17.5 17.36,16.16 C6.2 16,8.25 U$11.- | U$12.4 11.71,60.59 12.3,60.59 | 12.3,60.59 C2.2 | v28.3,52.8 27.9,53.2 U$5.SCL 26.22,53.63 v26.22,54.1 | R7.2 R9.2 R8.2 | R7.2 R12.2 18.58,37.38 Q2.3 | GND.1 14.95,22.34 | 14.95,22.34 14.1,23.2 v14.1,24 14.98,24.89 GND.3 18.56,24.89 R10.2 | Q3.1 15,28.59 14.1,27.7 | Q3.3 15.23,31.13 14.1,30 | 14.1,33.9 15.05,34.84 Q2.1 18.59,34.84 R7.2 | DATA.C PWR.C WIFI.C 29.92,35.18 26.51,38.59 23.69,38.59 IC4.7 22.5,37.4 v22.5,37.3 | v14.1,60.6 12.31,60.6 12.3,60.59 | J2.6 24.6,54.85 24.6,53.8 | 24.6,53.8 v24.6,47.9 | 14.95,22.34 14.94,22.34 12.98,20.38 IC2.3 12.98,18.12 v13.2,17.9 | R11.2 18.8,27.2 14.1,27.2 | v23.8,53 24.6,53.8
  Top 0.406: v12.75,51.7 IC1.3 | v12.75,51.7 13.2,51.7 13.7,51.2 13.7,50.38 IC1.5 11.59,48.28 C3.2 11.59,47.61 v12.4,46.8 | IC1.21 17.28,55.1 16.15,55.1 | 16.15,55.1 v12.75,51.7 | 16.15,55.1 14.5,55.1 v14.2,55.4 | v18.1,51.9 18.1,51.86 17.4,51.17 16.63,51.17 v15.9,51.9 | v12.75,51.71 v12.75,51.7
  Top 0.508: U$10.+PWR U$10.SDA 6.6,54.7 v7.5,53.8 8.3,53 8.3,46.4 v14.1,40.6 14.1,33.9 14.1,30 14.1,27.7 14.1,27.2 v14.1,24 | v4.8,32.67 4.8,35.27 U$14.6 v4.5,36.3
  Bottom 0.254: AC1.4 18.06,35.6 C4.2 | AC1.5 AC1.4 | AC1.2 15.4,37.2 15.1,36.9 15.1,35.8 15.3,35.6 AC1.4 | R4.1 v18.7,17.5 18.1,18.1 18.1,20.3 19.76,21.96 U1.9 | IC3.5 IC3.6 IC3.7 IC3.8 19.81,2.9 v21.9,2.9 | IC3.9 IC3.10 IC3.11 IC3.12 IC3.13 8.26,7.95 v6.2,10 | v28.3,52.8 29.04,52.06 U$9.6 | C5.2 14.1,59 v14.1,60.6 | v24.6,47.9 22.4,47.9 19.8,50.5 U3.7 | v22.5,37.3 21.35,37.3 C1.2 20.5,38.15 R18.1 | U$7.GND 5.3,44.3 8.1,41.5 13.2,41.5 v14.1,40.6 | U$6.GND v7.5,53.8 | U$1.P$4 13,17.7 v13.2,17.9 | v26.22,54.1 25.11,53 v23.8,53
  Bottom 0.406: v14.2,55.4 14.2,57.4 C5.2 | v14.1,40.6 14.1,45.1 v12.4,46.8 | U3.7 18.71,51.29 v18.1,51.9 | v15.9,51.9 12.94,51.9 v12.75,51.71
  Bottom 0.508: v14.1,24 16.14,21.96 U1.9 U1.7 | U3.7 U3.9 23.7,46.21 U$9.9 | v4.8,32.67 5.39,32.08 U$3.P$4 | v4.5,36.3 5.6,37.4 5.6,39.2 7,40.6 v14.1,40.6
GPIO6  (via drill 0.35)
  Top 0.254: v25.7,9.8 26.6,9.8 27.3,10.5 27.3,11.3 26.65,11.95 U$13.2
  Bottom 0.254: U$9.31 25.7,16.79 v25.7,9.8
GPIO16  (via drill 0.35)
  Top 0.254: v27.3,14.9 26.12,14.9 U$13.5
  Bottom 0.254: U$9.36 27.59,14.9 v27.3,14.9
GPIO20  (via drill 0.35)
  Top 0.254: v28.4,12.2 26.65,13.95 U$13.4
  Bottom 0.254: U$9.38 29.04,11.56 v28.4,12.2
GPIO21  (via drill 0.35)
  Top 0.254: v27.31,12.21 26.58,12.95 U$13.3
  Bottom 0.254: U$9.40 28.23,8.37 26.6,10 26.6,11.5 v27.31,12.21
GREEN_LED  (via drill 0.35)
  Top 0.254: R14.2 23.5,31 23.8,31.3 23.8,35.9 25,37.1 v25.8,37.1
  Bottom 0.254: v25.8,37.1 27.29,37.1 U$9.16
I/0  (via drill 0.35)
  Top 0.254: IC1.10 17.5,47.42 17.5,40.8 18.8,39.5 20.44,39.5 20.68,39.27 20.68,39.22 20.7,39.2 20.7,27.6 21.2,27.1 21.2,26.5 21.7,26 21.7,23.2 22.8,22.1 v22.9,22.1
  Bottom 0.254: v22.9,22.1 23.93,21.07 U$9.29
INT0_WIFI  (via drill 0.35)
  Top 0.254: v26.9,36.4 26.9,37.3 26.3,37.9 24.6,37.9 23.2,36.5 22.2,36.5 21.7,37 21.7,40.7 20.6,41.8 19.6,41.8 19.4,42 v19.4,42.6 | IC1.1 9.3,50.51 9.3,46.7 14.1,41.9 v14.9,41.9
  Bottom 0.254: U$9.22 28.27,31.23 26.9,32.6 v26.9,36.4 | v19.4,42.6 15.6,42.6 v14.9,41.9
INT1  (via drill 0.35)
  Top 0.254: IC1.32 9.91,53.17 v9.91,52.51 | v5.7,52.2 5.7,43.1 4.5,41.9 4.5,40.8 5,40.3 U$14.2
  Bottom 0.254: v9.91,52.51 9.6,52.2 v5.7,52.2
IO2  (via drill 0.35)
  Top 0.254: U$14.3 v8.3,39.3 | IC1.12 18.7,48.48 18.7,41.7 v19.1,41.3
  Bottom 0.254: v8.3,39.3 17,39.3 17.6,39.9 17.7,39.9 v19.1,41.3
N$2
  Bottom 0.254: C1.1 20.75,30.53 U1.6
N$3
  Bottom 0.406: U3.6 19.4,53.43 16,53.43 15.05,54.38 15.05,57.15 C5.1
N$8
  Top 0.254: R15.1 WIFI.A
N$10
  Top 0.254: R13.1 DATA.A
N$11
  Top 0.254: R14.1 PWR.A
PGRM_EN
  Top 0.254: IC4.9 IC4.10 25.87,40.73 24.6,42 IC4.4 24.9,42 25.9,43 25.9,43.9 25.26,44.54 IC4.2
PGRM_MISO_ATMEGA
  Top 0.254: IC4.1 22,47.1 22,49.9 20.42,51.48 IC1.16 21.5,52.74 21.5,54.8 20.7,55.6 20.7,57.2 22.4,58.9 22.4,60.65 J2.1
PGRM_MISO_PI  (via drill 0.35)
  Top 0.254: IC4.13 27.44,44.54 v27.1,44.2
  Bottom 0.254: v27.1,44.2 24.29,41.39 U$9.13
PGRM_MOSI_ATMEGA  (via drill 0.35)
  Top 0.254: IC4.11 29.9,42 30.3,42.4 30.3,46.1 29.2,47.2 v25.8,47.2 25.8,47.73 25.09,48.43 25.09,56.16 J2.4 | IC1.15 21.3,49.28 v21.3,47.7
  Bottom 0.254: v21.3,47.7 21.8,47.2 v25.8,47.2
PGRM_MOSI_PI  (via drill 0.35)
  Top 0.254: v27.2,42.5 27.97,43.27 IC4.12
  Bottom 0.254: U$9.15 26.15,38.85 27.2,39.9 v27.2,42.5
PGRM_RST_ATMEGA  (via drill 0.35)
  Top 0.254: C2.1 10.11,58.91 U$12.1 7.8,58.9 R19.2 | IC1.29 11.2,55.98 11.2,56.5 12.5,57.8 C2.1 | IC4.8 29.99,38.19 30.78,38.98 30.78,46.3 29.18,47.9 26.2,47.9 25.5,48.6 25.5,54.5 28.2,57.2 v28.2,58.26 | C2.1 14.21,58.91 16.8,61.5 18.05,61.5 18.53,61.03 v18.63,61.03 19.92,59.74 J2.5
  Bottom 0.254: v28.2,58.26 26.14,58.26 23.2,61.2 18.8,61.2 v18.63,61.03
PGRM_RST_PI  (via drill 0.35)
  Top 0.254: v26.9,45.6 26.4,45.1 v26.4,41.6 | v25.8,39.7 25.56,39.46 IC4.6
  Bottom 0.254: U$9.7 25.39,49.01 26.7,47.7 26.7,45.8 v26.9,45.6 | v26.4,41.6 26.4,40.3 v25.8,39.7
PGRM_SCK_ATMEGA  (via drill 0.35)
  Top 0.254: J2.3 21.6,59.65 21.6,58.7 20.2,57.3 20.2,55.3 21,54.5 21,54.29 IC1.17 19.33,52.62 17.72,52.62 v17,51.9 | IC4.3 22.23,43.27 v21.9,43.6
  Bottom 0.254: v21.9,43.6 21.9,43.7 21.1,44.5 18.4,44.5 17,45.9 v17,51.9
PGRM_SCK_PI  (via drill 0.35)
  Top 0.254: IC4.5 22.37,40.73 21.9,41.2 v21.9,42.6
  Bottom 0.254: v21.9,42.6 23.23,43.93 U$9.11
PI_3.3V
  Bottom 0.254: AC1.7 16,33.9 AC1.6 18.9,34 19.4,34.5 19.4,36.1 | AC1.1 17.34,38 C4.1 18.41,37.09 19.4,36.1 | 19.4,36.1 19.6,36.3 U$9.17
PI_5V  (via drill 0.35)
  Top 0.254: IC2.8 v12.98,16.62 | IC2.4 12.48,17.12 v12.98,16.62 | v9.7,15.8 U$2.2 5.2,15.8 4.2,16.8 4.2,20.6 v4.9,21.3 | U$13.1 25.62,10.5 v21.9,10.5 | v12.98,16.62 14.2,17.84 C6.1 | IC4.14 28.12,46.4 24.7,46.4 23.6,47.5 v23.6,50.3 | v4.4,28 5.1,28.7 U$8.2 5,28.7 3.9,29.8 3.9,33.2 4.26,33.56 4.26,34.84 v3.7,35.4 | v2.8,39.6 v2.8,36.7
  Bottom 0.254: R17.2 R16.2 20.6,60.7 22.9,60.7 26.2,57.4 28.27,57.4 U$9.2 | v9.7,15.8 12.16,15.8 v12.98,16.62 13.08,16.62 15.3,14.4 15.3,13.2 18.02,10.48 IC3.2 19.78,10.5 v21.9,10.5 | 10.83,52.7 10.83,50.43 6.4,46 6.4,45.6 6.35,45.55 U$7.+PWR 4.55,45.55 4.1,45.1 4.1,40.9 v2.8,39.6 | U$1.P$1 5.05,21.45 v4.9,21.3 4.9,27.5 v4.4,28 | v2.8,36.7 2.8,36.2 3.6,35.4 v3.7,35.4 6.35,35.4 U$3.P$1
  Bottom 0.305: U3.5 8.73,54.8 U$6.+PWR
  Bottom 0.508: U$9.2 28.83,56.63 27,54.8 27,51.6 25.7,50.3 v23.6,50.3 22.6,50.3 21.6,51.3 21.6,51.9 20.8,52.7 10.83,52.7 U3.5
PI_GND4  (via drill 0.35)
  Top 0.254: v28.5,15 27.55,15.95 U$13.6
  Bottom 0.254: U$9.34 29.04,15.54 v28.5,15
PI_ON  (via drill 0.35)
  Top 0.254: v16.3,46.2 16.28,46.23 IC1.9
  Bottom 0.254: R18.2 20.5,42.97 U3.10 18.1,43.67 16.3,45.47 v16.3,46.2
RED_LED  (via drill 0.35)
  Top 0.254: v23.3,25.2 22.35,26.15 R13.2
  Bottom 0.254: U$9.32 27.57,18.53 27.2,18.9 27.2,25 27,25.2 v23.3,25.2
REED  (via drill 0.35)
  Top 0.254: U$10.GND 4.2,56.7 3.8,56.3 3.8,53.3 4.2,52.9 6.1,52.9 6.5,52.5 6.5,45.5 12.4,39.6 v12.4,24 | v17.4,20.7 v19.8,20.7
  Bottom 0.254: R5.1 R4.2 20.4,18.82 U1.10 v19.8,20.7 | v12.4,24 15.7,20.7 v17.4,20.7
RPI_RX  (via drill 0.35)
  Top 0.254: v26.7,48.8 26.65,48.85 U$5.GND
  Bottom 0.254: U$9.10 v26.71,48.8 v26.7,48.8
RPI_TX  (via drill 0.35)
  Top 0.254: v28.4,50.4 27.6,51.2 U$5.+PWR
  Bottom 0.254: U$9.8 29.04,49.76 v28.4,50.4
SCL  (via drill 0.35)
  Top 0.254: v14.2,13.5 13.98,13.72 IC2.10 | v22.16,52.8 22.16,55.64 v21.5,56.3 | v4.9,57.7 4.4,57.7 3.2,56.5 3.2,53.1 4.2,52.1 v4.6,52.1 | v4.2,48.5 4.2,42.37 v1.88,40.05 | v4.9,18 v4.9,20.2 | v2.1,32.5 3.6,34 v3.6,34.08
  Bottom 0.254: U$9.5 23.35,51.55 22.1,52.8 v22.16,52.8 | v14.2,13.5 12.45,11.76 IC3.16 7.95,11.76 5.5,14.2 5.5,17.4 v4.9,18 | v21.5,56.3 21.5,58.1 R17.1 20.93,57.83 20.93,57.45 20.27,56.79 17.93,56.79 17.49,57.23 17.49,61.03 17.13,61.39 9.89,61.39 7.6,59.1 7.6,57.8 6.6,56.8 U$6.SCL 5.3,57.3 v4.9,57.7 | v4.6,52.1 5.3,51.4 U$7.SCL 5.15,47.55 v4.2,48.5 | v1.88,40.05 1.88,35.72 3.52,34.08 v3.6,34.08 6.28,34.08 U$3.P$2 6.8,34.6 8.3,34.6 12.4,38.7 14.7,38.7 15,38.4 AC1.14 | U$1.P$2 v4.91,20.2 v4.9,20.2 2.2,20.2 1.9,20.5 1.9,32.3 v2.1,32.5
SDA  (via drill 0.35)
  Top 0.254: v13.6,11.9 13.48,12.02 IC2.9
  Bottom 0.254: U$9.3 25.09,54.09 26.7,55.7 26.7,56.1 23.05,59.75 R16.1 21.15,59.75 20.52,59.12 20.52,57.62 20.1,57.2 18.2,57.2 17.9,57.5 17.9,61.2 17.3,61.8 7.6,61.8 3.5,57.7 3.5,56.3 | v13.6,11.9 12.19,10.48 IC3.15 8.31,10.48 4.9,13.9 4.9,16.6 4,17.5 | U$6.SDA 4,55.8 3.5,56.3 | 3.5,56.3 3.5,47.1 | U$7.SDA 4.05,46.55 3.5,47.1 | 3.5,47.1 3.5,42.6 1.22,40.32 1.22,34.78 | 1.22,34.78 2.67,33.33 U$3.P$3 8.33,33.33 13,38 AC1.13 | 4,17.5 4,18.4 4.55,18.95 U$1.P$3 | 1.22,34.78 1.22,20.28 4,17.5
TOP
  pour Top (isolate 0.406): -1.96,68.07 34.83,68.07 34.83,-2.35 -2.22,-2.35 -2.22,68
VBAT  (via drill 0.35)
  Top 0.254: v7.4,10 6.8,9.4 U$11.+1 6.8,3 8.58,1.22 22.2,1.22 23.2,2.22 U$11.+
  Bottom 0.254: v7.4,10 8.19,9.21 IC3.14
VIN  (via drill 0.35)
  Top 0.508: U$10.SCL 6.4,53.7 7.4,52.7 v7.4,45.8 13.2,40 13.2,21.7 v12.6,21.1 | v7.9,29.7 U$8.1 | U$2.1 8.14,16.8 v9.7,18.36
  Bottom 0.254: R5.2 16.6,14.8 14.7,16.7 14.7,19 v12.6,21.1
  Bottom 0.508: v7.4,45.8 9.53,43.67 U3.1 | v7.9,29.7 7.9,25.8 v12.6,21.1 10.92,19.42 U1.1 v9.7,18.36

### Text on the board
tNames: RESET | GND | GND | REED | VIN | GND | TX | RX | 5V | INT1 | IO2 | D1 | D2 | GND | VIN | PI_5V | D3 | D4 | D5 | D6 | Minion_2.7 | Jackson Sugar | VIN | PI_5V | GND | A1 | GP36 | A2 | GP38 | A3 | GP40 | GND | GP31 | PI_5V
bNames: SCL | 5V | SDA | GND | SCL | SDA | 5V | GND